# EAGLE design BlinkyLight (EAGLE 9.6.2)
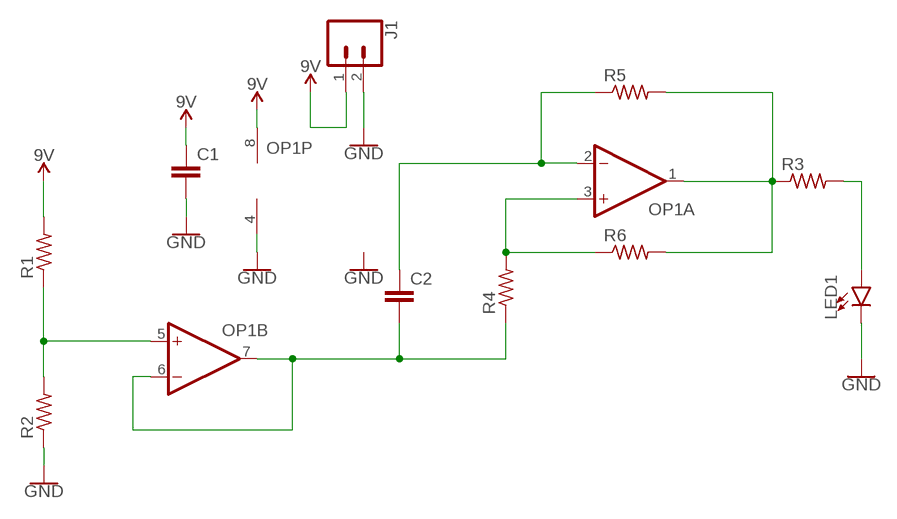
[diagram p0: schematic, sheet 1]

## Parts
C1  CAPACITOR0603  [C0603]
C2  CAPACITOR0603  [C0603]
J1  CONN_02  [1X02]
LED1  LED5MM  [LED_5MM]
OP1  OP-DUALR  [SO8]
R1  RESISTOR0603  [R0603]
R2  RESISTOR0603  [R0603]
R3  RESISTOR0603  [R0603]
R4  RESISTOR0603  [R0603]
R5  RESISTOR0603  [R0603]
R6  RESISTOR0603  [R0603]

## Nets
9V: C1.1 J1.1 OP1.8(P:V+) R1.2
GND: C1.2 J1.2 LED1.K(C) OP1.4(P:V-) R2.1
N$1: OP1.5(B:+IN) R1.1 R2.2
N$2: C2.2 OP1.6(B:-IN) OP1.7(B:OUT) R4.1
N$3: OP1.3(A:+IN) R4.2 R6.1
N$4: OP1.1(A:OUT) R3.1 R5.2 R6.2
N$5: LED1.A R3.2
N$6: C2.1 OP1.2(A:-IN) R5.1

## Library data of the parts
C1 C2 = LinnesLab-Passives:CAPACITOR
J1 = LinnesLab-Connectors:CONN_02: Multi connection point. Often used as Generic Header-pin footprint for 0.1 inch spaced/style header connections On any of the 0.1 inch spaced packages, you can populate with these: Break Away Headers - Straight <https://www.sparkfun.com/products/116> (PRT-00116) Break Away Male Headers - Right Angle <https://www.sparkfun.com/products/553> (PRT-00553) Female Headers <https://www.sparkfun.com/products/115> (PRT-00115) Break Away Headers - Machine Pin <https://www.sparkfun.com/products/117> (PRT-00117) Break Away Female Headers - Swiss Machine Pin <https://www.sparkfun.com/products/743> (PRT-00743) For SCREWTERMINALS and SPRING TERMINALS visit here: Screw Terimnals on SparkFun.com <https://www.sparkfun.com/search/results?term=Screw+Terminals> (5mm/3.5mm/2.54mm spacing) This device is also useful as a general connection point to wire up your design to another part of your project. Our various solder wires solder well into these plated through hole pads. Hook-Up Wire - Assortment (Stranded, 22 AWG) <https://www.sparkfun.com/products/11375> (PRT-11375) Hook-Up Wire - Assortment (Solid Core, 22 AWG) <https://www.sparkfun.com/products/11367> (PRT-11367) View the entire wire category on our website here <https://www.sparkfun.com/categories/141> Special notes: Molex polarized connector foot print use with: PRT-08233 with associated crimp pins and housings. 2.54_SCREWTERM for use with PRT-10571. 3.5mm Screw Terminal footprints for PRT-08084 5mm Screw Terminal footprints for use with PRT-08432
LED1 = LinnesLab-LED:LED: LED (Generic) Standard schematic elements and footprints for 5mm, 3mm, 1206, and 0603 sized LEDs. Generic LEDs with no color specified. LTST-C190KGKT: arrow indicates cathode
OP1 = LinnesLab-AnalogIC:OP-DUAL: Precision Micropower, Low Noise CMOS, Rail-to-Rail Input/Output Operational Amplifiers Source: http://www.analog.com/static/imported-files/data_sheets/AD8603_8607_8609.pdf; MPN: AD8607ARMZ-R2; OC_FARNELL: 1651293; OC_NEWARK: 19M8927
R1-R6 = LinnesLab-Passives:RESISTOR

## Board
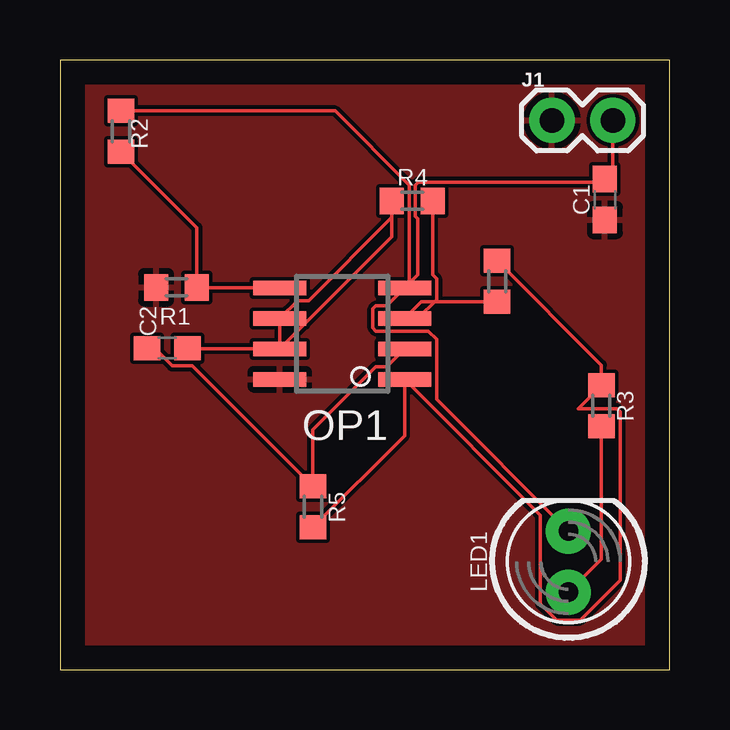
[diagram p1: board, top side]
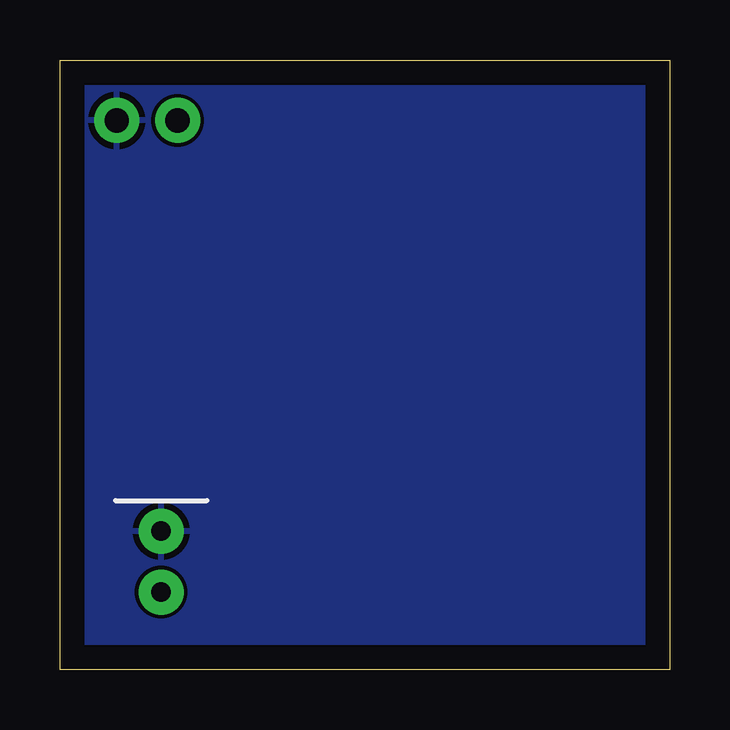
[diagram p2: board, bottom side, seen from below]

Size 25.4 x 25.4 mm. Coordinates in mm from the lower left corner, seen from the top.
Outline: 0,0 25.4,0 25.4,25.4 0,25.4 0,0
Copper layers (1*16): Top 0.035mm / dielectric 1.5mm / Bottom 0.035mm
Design rules "default": minimum track width 6mil, minimum drill 0.35mm, track to track 6mil, track to pad 6mil, pad to pad 6mil, via to via 6mil, smd to smd 6mil, copper to edge 40mil, drill to drill 6mil, minimum pad ring 10mil, minimum via ring 8mil, stop-mask expansion 4mil, vias tented up to drill 0mil, thermal gap 10mil

### Footprints (pad centres in the part's own frame; a part is rotated, then mirrored left to right if it is on the bottom)
C0603 = smd 1.1 x 1: 1 -0.85,0; 2 0.85,0
1X02 = drill 1.016 pad 1.88: 1 0,0; 2 2.54,0
LED_5MM = drill 0.813 pad 1.88: A -1.27,0; K 1.27,0
SO8 = smd 0.6 x 2.2: 1 -1.905,-2.6; 2 -0.635,-2.6; 3 0.635,-2.6; 4 1.905,-2.6; 5 1.905,2.6; 6 0.635,2.6; 7 -0.635,2.6; 8 -1.905,2.6
R0603 = smd 1 x 1.1: 1 -0.85,0; 2 0.85,0

### Placement (x,y rotation side)
C1  22.71,19.58 90 top
C2  4.47,13.39 0 top
J1  20.5,22.89 0 top
LED1  21.18,4.5 90 top
OP1  11.76,14 90 top
R1  4.85,15.93 180 top
R2  2.54,22.43 270 top
R3  22.56,11 270 top
R4  14.68,19.53 0 top
R5  10.54,6.78 270 top
R6  18.21,16.18 90 top

### Tracks (layer width: path | path; a pad name or v marks a point on that pad's centre or on a via)
9V
  pour Top: 0.46,24.99 25.04,24.99 25.04,0.41 0.46,0.41 0.46,0.81 0.46,24.97 0.48,24.97
GND
  Top 0.152: J1.2 23.04,20.76 C1.2 22.59,20.31 14.94,20.31 14.8,20.18 14.8,18.89 14.91,18.78 14.91,16.45 14.56,16.1 | 14.56,16.1 14.56,20.18 11.46,23.28 R2.1 | 14.56,16.1 OP1.4 13.62,15.16 13.17,15.16 13.03,15.03 13.03,14.24 13.17,14.1 15.34,14.1 15.69,13.76 15.69,11.26 LED1.K
  pour Bottom: 0.46,25.32 25.17,25.32 25.17,0.36 0.41,0.36 0.41,25.43
N$1
  Top 0.152: R2.2 5.7,18.42 R1.1 5.77,15.93 5.79,15.9 OP1.5
N$2
  Top 0.152: OP1.7 13.83,18.03 R4.1 13.83,18.85 10.36,15.37 9.9,15.37 OP1.6 OP1.7 | OP1.7 5.35,13.36 C2.2
N$3
  Top 0.152: R4.2 15.53,16.45 15.69,16.3 15.69,15.41 14.91,14.63 OP1.3 15.06,15.33 R6.1
N$4
  Top 0.152: R5.2 14.36,9.75 OP1.1 20.02,6.43 20.02,2.74 20.7,2.06 21.67,2.06 23.33,3.72 23.33,10.74 23.2,10.88 21.58,10.88 R3.1 22.55,12.69 R6.2
N$5
  Top 0.152: R3.2 22.55,4.6 LED1.A
N$6
  Top 0.152: C2.1 3.95,13.39 4.68,12.66 5.52,12.66 R5.1 10.54,9.99 13.17,12.62 13.62,12.62 OP1.2